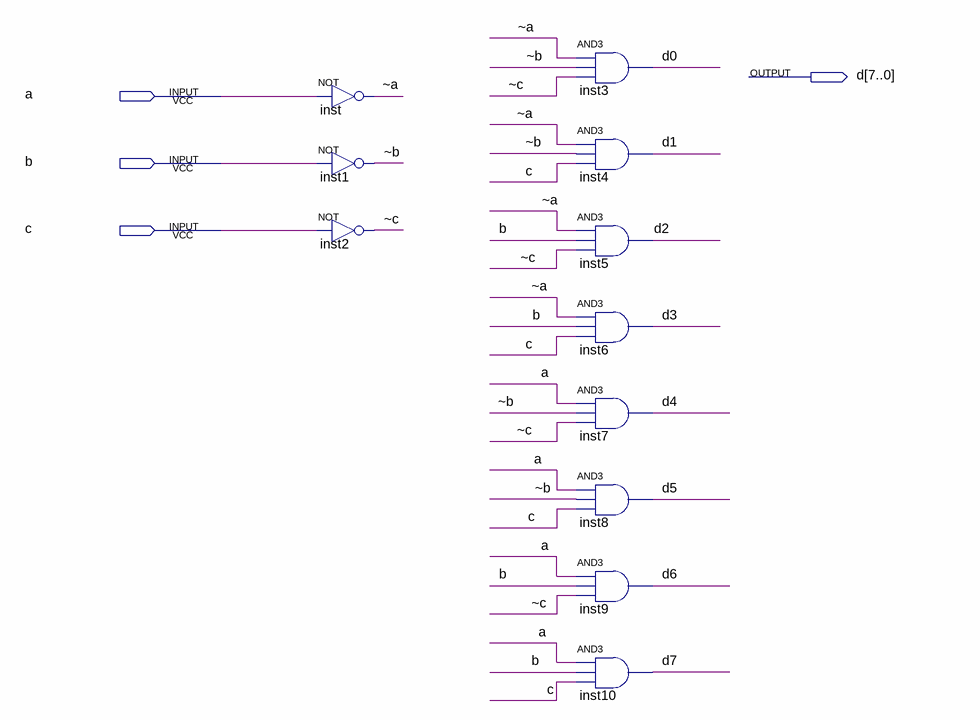
[diagram p0: schematic sheet]
// Quartus schematic decod3x8.bdf as structural Verilog: 11 symbols, 4 pins
module decod3x8 (
  input  a,
  input  b,
  input  c,
  output [7:0] d
);

  wire \~a , \~b , \~c ;

  not inst (\~a , a);
  not inst1 (\~b , b);
  not inst2 (\~c , c);
  and inst3 (d[0], \~a , \~b , \~c );
  and inst4 (d[1], \~a , \~b , c);
  and inst5 (d[2], \~a , b, \~c );
  and inst6 (d[3], \~a , b, c);
  and inst7 (d[4], a, \~b , \~c );
  and inst8 (d[5], a, \~b , c);
  and inst9 (d[6], a, b, \~c );
  and inst10 (d[7], a, b, c);
endmodule
